# Altium project ExoSkeleton Master PCB V1.0.PrjPcb
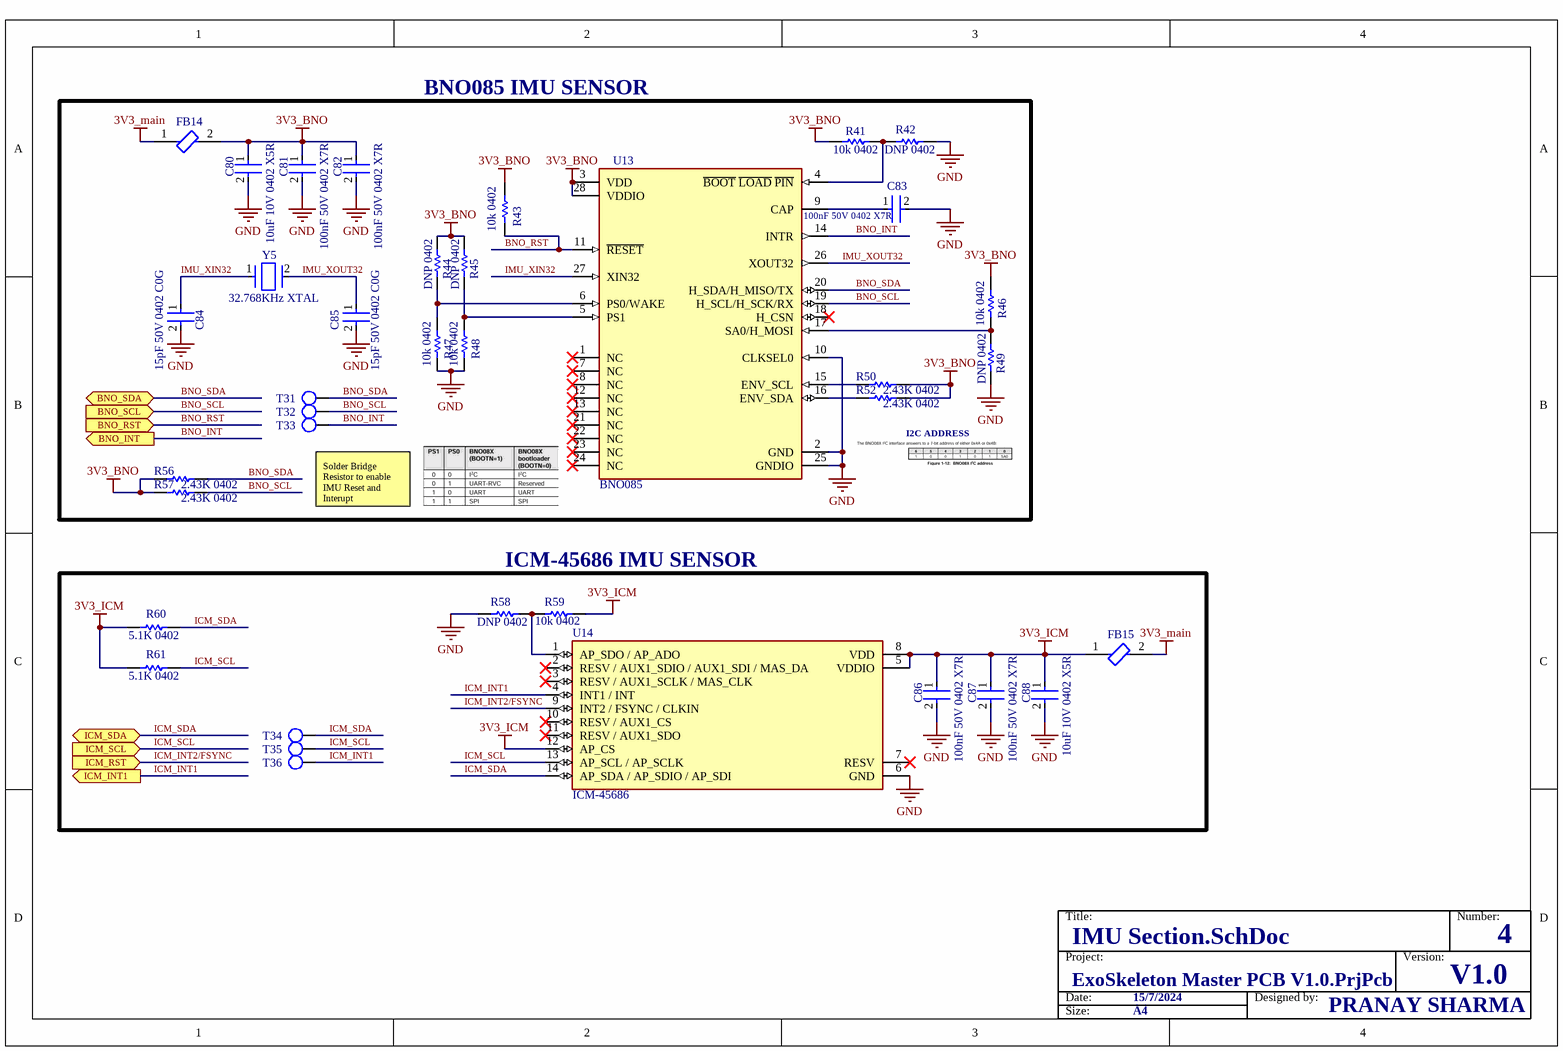
[diagram p0: IMU Section.SchDoc]
1 sheet, 37 parts. Net scope: flat (ports and power ports of the same name join across sheets).
Board file: PCB V1.0.PcbDoc

## Sheet IMU Section.SchDoc
size A4; SheetNumber: 4; SheetTotal: 7

### Parts
C80  10uF 10V 0402 X5R  [0402 IPC CLASS C CAPACITOR]
C81  100nF 50V 0402 X7R  [0402 IPC CLASS C CAPACITOR]
C82  100nF 50V 0402 X7R  [0402 IPC CLASS C CAPACITOR]
C83  100nF 50V 0402 X7R  [0402 IPC CLASS C CAPACITOR]
C84  15pF 50V 0402 C0G  [0402 IPC CLASS C CAPACITOR]
C85  15pF 50V 0402 C0G  [0402 IPC CLASS C CAPACITOR]
C86  100nF 50V 0402 X7R  [0402 IPC CLASS C CAPACITOR]
C87  100nF 50V 0402 X7R  [0402 IPC CLASS C CAPACITOR]
C88  10uF 10V 0402 X5R  [0402 IPC CLASS C CAPACITOR]
FB14  BLM15AX102SN1D  [0402 IPC CLASS C FERRITE BEAD]  (value not drawn)
FB15  BLM15AX102SN1D  [0402 IPC CLASS C FERRITE BEAD]  (value not drawn)
R41  10k 0402  [0402 IPC CLASS C RESISTOR]
R42  DNP 0402  [0402 IPC CLASS C RESISTOR]
R43  10k 0402  [0402 IPC CLASS C RESISTOR]
R44  DNP 0402  [0402 IPC CLASS C RESISTOR]
R45  DNP 0402  [0402 IPC CLASS C RESISTOR]
R46  10k 0402  [0402 IPC CLASS C RESISTOR]
R47  10k 0402  [0402 IPC CLASS C RESISTOR]
R48  10k 0402  [0402 IPC CLASS C RESISTOR]
R49  DNP 0402  [0402 IPC CLASS C RESISTOR]
R50  2.43K 0402  [0402 IPC CLASS C RESISTOR]
R52  2.43K 0402  [0402 IPC CLASS C RESISTOR]
R56  2.43K 0402  [0402 IPC CLASS C RESISTOR]
R57  2.43K 0402  [0402 IPC CLASS C RESISTOR]
R58  DNP 0402  [0402 IPC CLASS C RESISTOR]
R59  10k 0402  [0402 IPC CLASS C RESISTOR]
R60  5.1K 0402  [0402 IPC CLASS C RESISTOR]
R61  5.1K 0402  [0402 IPC CLASS C RESISTOR]
T31  TP  [Testpoint1]  (value not drawn)  (no BOM)
T32  TP  [Testpoint1]  (value not drawn)  (no BOM)
T33  TP  [Testpoint1]  (value not drawn)  (no BOM)
T34  TP  [Testpoint1]  (value not drawn)  (no BOM)
T35  TP  [Testpoint1]  (value not drawn)  (no BOM)
T36  TP  [Testpoint1]  (value not drawn)  (no BOM)
U13  BNO085  [LGA-28 BNO055 IPC-C]
U14  ICM-45686  [LGA-14 ICM-45686 IPC-C]
Y5  32.768KHz XTAL  [SMD3215-2P IPC-C]

### Blocks framed on the sheet
BNO085 IMU SENSOR: C80-C85 FB14 R41-R50 R52 R56 R57 T31-T33 U13 Y5
ICM-45686 IMU SENSOR: C86-C88 FB15 R58-R61 T34-T36 U14

### Ports
BNO_INT (out), BNO_RST (in), BNO_SCL (in), BNO_SDA (bidir), ICM_INT1 (out), ICM_RST (in), ICM_SCL (in), ICM_SDA (bidir)

### Nets
3V3_BNO: C80.1 C81.1 C82.1 FB14.2 R41.1 R43.2 R44.2 R45.2 R46.2 R50.2 R52.2 R56.1 R57.1 U13.3(VDD) U13.28(VDDIO)
3V3_ICM: C86.1 C87.1 C88.1 FB15.1 R59.1 R60.1 R61.1 U14.5(VDDIO) U14.8(VDD) U14.12(AP_CS)
3V3_main: FB14.1 FB15.2
GND: C80.2 C81.2 C82.2 C83.2 C84.2 C85.2 C86.2 C87.2 C88.2 R42.1 R47.1 R48.1 R49.1 R58.2 U13.2(GND) U13.10(CLKSEL0) U13.25(GNDIO) U14.6(GND)
BNO_INT: T33.0 U13.14(INTR) ; port BNO_INT
BNO_RST: R43.1 U13.11(~{RESET}) ; port BNO_RST
BNO_SCL: R57.2 T32.0 U13.19(H_SCL/H_SCK/RX) ; port BNO_SCL
BNO_SDA: R56.2 T31.0 U13.20(H_SDA/H_MISO/TX) ; port BNO_SDA
ICM_INT1: T36.0 U14.4(INT1_/_INT) ; port ICM_INT1
ICM_INT2/FSYNC: U14.9(INT2_/_FSYNC_/_CLKIN) ; port ICM_RST
ICM_SCL: R61.2 T35.0 U14.13(AP_SCL_/_AP_SCLK) ; port ICM_SCL
ICM_SDA: R60.2 T34.0 U14.14(AP_SDA_/_AP_SDIO_/_AP_SDI) ; port ICM_SDA
IMU_XIN32: C84.1 U13.27(XIN32) Y5.1
IMU_XOUT32: C85.1 U13.26(XOUT32) Y5.2
NetC83_1: C83.1 U13.9(CAP)
NetR41_2: R41.2 R42.2 U13.4(~{BOOT}_~{LOAD}_~{PIN})
NetR44_1: R44.1 R47.2 U13.6(PS0/WAKE)
NetR45_1: R45.1 R48.2 U13.5(PS1)
NetR46_1: R46.1 R49.2 U13.17(SA0/H_MOSI)
NetR50_1: R50.1 U13.15(ENV_SCL)
NetR52_1: R52.1 U13.16(ENV_SDA)
NetR58_1: R58.1 R59.2 U14.1(AP_SDO_/_AP_ADO)

Not connected (* = marked no-connect by the designer): U13 1(NC)* 7(NC)* 8(NC)* 12(NC)* 13(NC)* 18(H_CSN)* 21(NC)* 22(NC)* 23(NC)* 24(NC)*; U14 2(RESV_/_AUX1_SDIO_/_AUX1_SDI_/_MAS_DA)* 3(RESV_/_AUX1_SCLK_/_MAS_CLK)* 7(RESV)* 10(RESV_/_AUX1_CS)* 11(RESV_/_AUX1_SDO)*

### Notes on the sheet
- I2C ADDRESS
- Solder Bridge Resistor to enable IMU Reset and Interupt
- Title:
- Number:
- Date:
- Project:
- 15/7/2024
- Designed by:
- Version:
- V1.0
- Size:
- A4
- PRANAY SHARMA

### Library data of the parts
R41 R43 R46-R48 R59 = 10k 1% 0402
R42 R44 R45 R49 R58 = 0R 1% 0402
R50 R52 R56 R57 = 2.43K 1% 0402
R60 R61 = 5.1K 1% 0402
T31-T36 = Testpoint1
Y5 = H31003271C2070CY